# Altium schematic sheet ADC.SchDoc
size 342 x 203 mm; PageSetup: Record=PageOptions|CenterHorizontal=True|CenterVertical=True|PrintScale=0.96|XCorrection=1.00|YCorrection=1.00|PrintKind=2|BorderSize=5000000|LeftOffset=0|BottomOffset=0|Orientation=2|PaperLength=1000|PaperWidth=1000|Scale=100|PaperSource=7|PrintQuality=-4|MediaType=1|DitherType=10|PaperKind=A4|PrintScaleMode=1
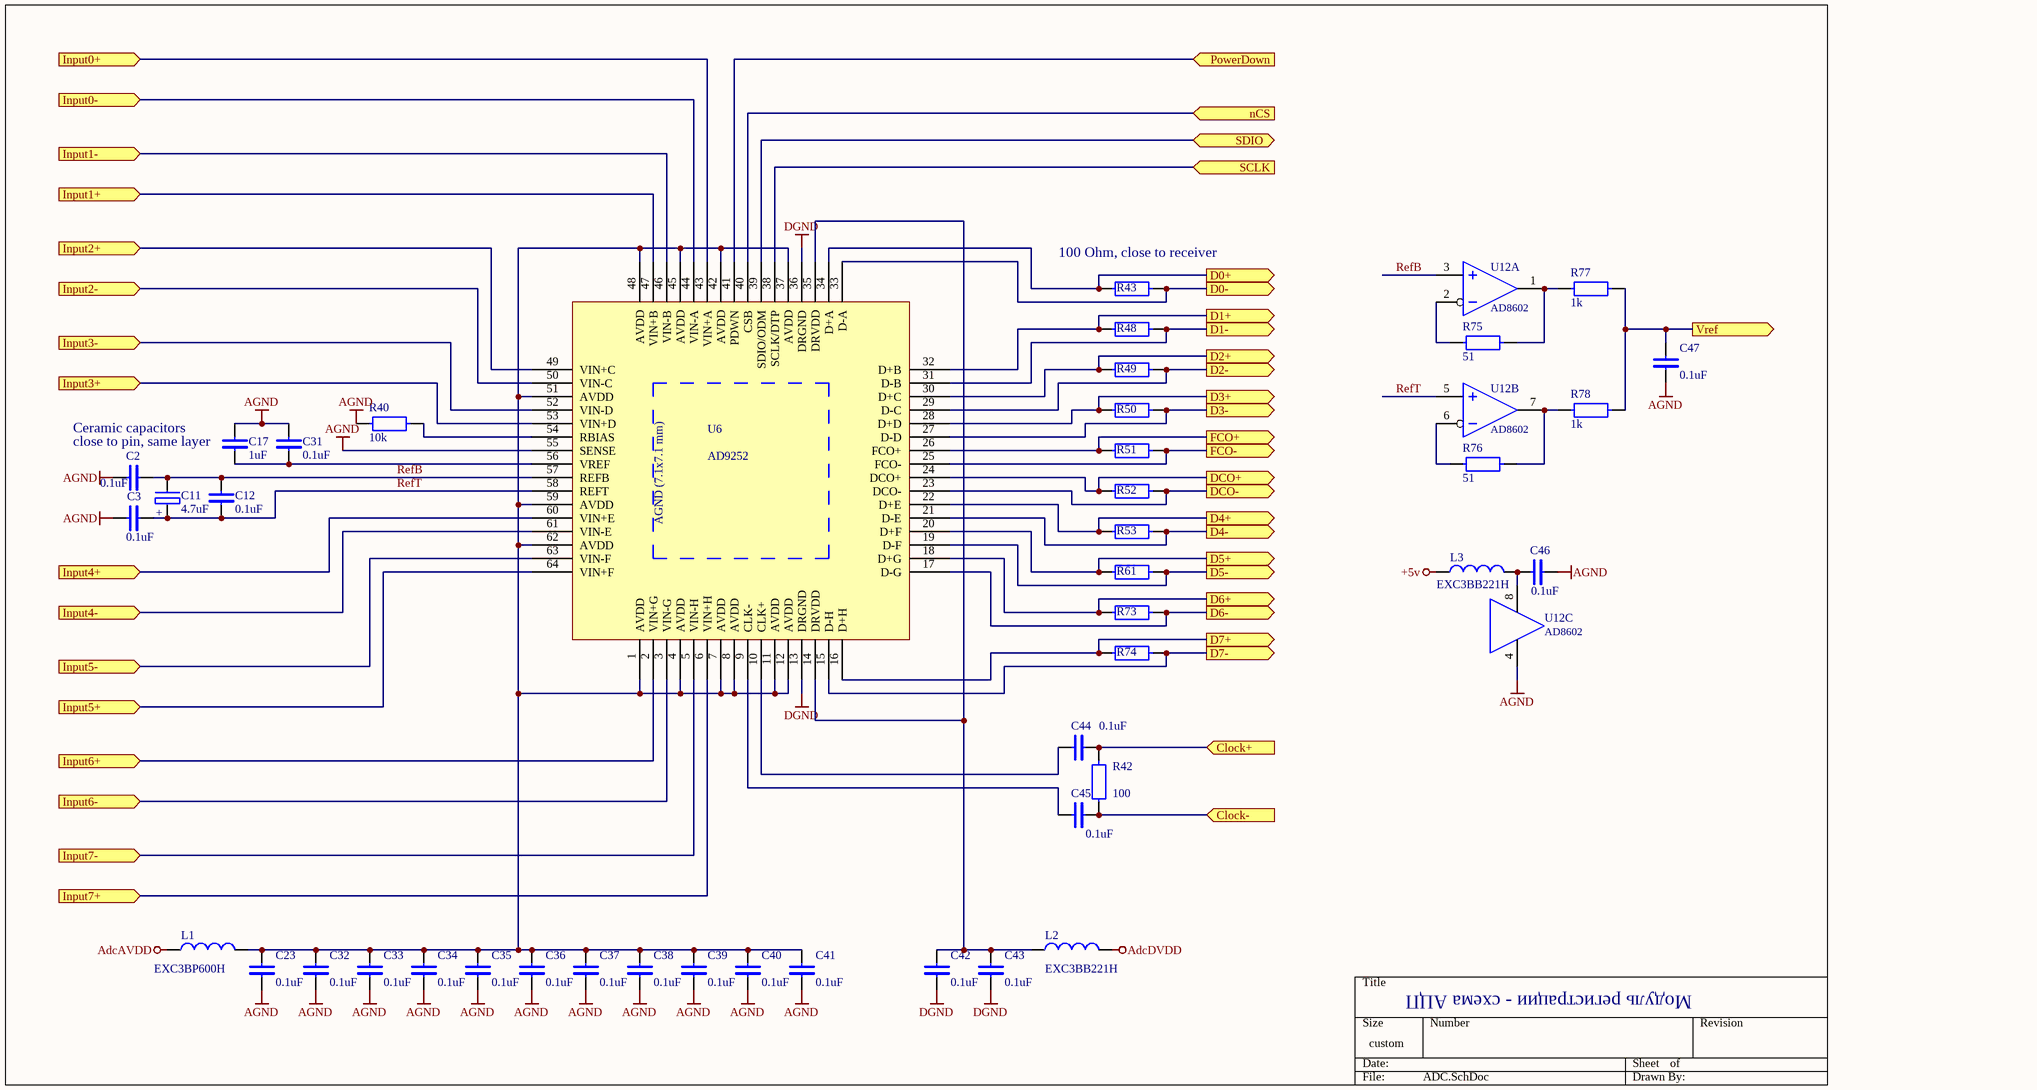
[diagram p0: ADC.SchDoc]

## Parts
C2  0.1uF  [0402]
C3  0.1uF  [0402]
C11  4.7uF  [CP3216]
C12  0.1uF  [0402]
C17  1uF  [0603]
C23  0.1uF  [0402]
C31  0.1uF  [0402]
C32  0.1uF  [0402]
C33  0.1uF  [0402]
C34  0.1uF  [0402]
C35  0.1uF  [0402]
C36  0.1uF  [0402]
C37  0.1uF  [0402]
C38  0.1uF  [0402]
C39  0.1uF  [0402]
C40  0.1uF  [0402]
C41  0.1uF  [0402]
C42  0.1uF  [0402]
C43  0.1uF  [0402]
C44  0.1uF  [0402]
C45  0.1uF  [0402]
C46  0.1uF  [0402]
C47  0.1uF  [0402]
L1  EXC3BP600H  [0603]
L2  EXC3BB221H  [0603]
L3  EXC3BB221H  [0603]
R40  10k  [0603]
R42  100  [0402]
R43  100  [0402]  (value not drawn)
R48  100  [0402]  (value not drawn)
R49  100  [0402]  (value not drawn)
R50  100  [0402]  (value not drawn)
R51  100  [0402]  (value not drawn)
R52  100  [0402]  (value not drawn)
R53  100  [0402]  (value not drawn)
R61  100  [0402]  (value not drawn)
R73  100  [0402]  (value not drawn)
R74  100  [0402]  (value not drawn)
R75  51  [0603]
R76  51  [0603]
R77  1k  [0603]
R78  1k  [0603]
U6  AD9252  [CP-64]
U12  AD8602  [8SOIC150]  (parts A,B,C of 3)

## Ports
Clock+ (in), Clock- (in), D0+ (out), D0- (out), D1+ (out), D1- (out), D2+ (out), D2- (out), D3+ (out), D3- (out), D4+ (out), D4- (out), D5+ (out), D5- (out), D6+ (out), D6- (out), D7+ (out), D7- (out), DCO+ (out), DCO- (out), FCO+ (out), FCO- (out), Input0+ (in), Input0- (in), Input1+ (in), Input1- (in), Input2+ (in), Input2- (in), Input3+ (in), Input3- (in), Input4+ (in), Input4- (in), Input5+ (in), Input5- (in), Input6+ (in), Input6- (in), Input7+ (in), Input7- (in), nCS (in), PowerDown (in), SCLK (in), SDIO (bidir), Vref (out)

## Nets
+5v: L3.1
AdcAVDD: L1.1
AdcDVDD: L2.2
AGND: C2.1 C3.2 C17.2 C23.1 C31.2 C32.1 C33.1 C34.1 C35.1 C36.1 C37.1 C38.1 C39.1 C40.1 C41.1 C46.1 C47.1 R40.1 U6.55(SENSE) U12.4(V-)
DGND: C42.1 C43.1 U6.13(DRGND) U6.36(DRGND)
Clock+: C44.1 R42.2 ; port Clock+
Clock-: C45.1 R42.1 ; port Clock-
D0+: R43.1 U6.34(D+A) ; port D0+
D0-: R43.2 U6.33(D-A) ; port D0-
D1+: R48.1 U6.32(D+B) ; port D1+
D1-: R48.2 U6.31(D-B) ; port D1-
D2+: R49.1 U6.30(D+C) ; port D2+
D2-: R49.2 U6.29(D-C) ; port D2-
D3+: R50.1 U6.28(D+D) ; port D3+
D3-: R50.2 U6.27(D-D) ; port D3-
D4+: R53.1 U6.22(D+E) ; port D4+
D4-: R53.2 U6.21(D-E) ; port D4-
D5+: R61.1 U6.20(D+F) ; port D5+
D5-: R61.2 U6.19(D-F) ; port D5-
D6+: R73.1 U6.18(D+G) ; port D6+
D6-: R73.2 U6.17(D-G) ; port D6-
D7+: R74.1 U6.16(D+H) ; port D7+
D7-: R74.2 U6.15(D-H) ; port D7-
DCO+: R52.1 U6.24(DCO+) ; port DCO+
DCO-: R52.2 U6.23(DCO-) ; port DCO-
FCO+: R51.1 U6.26(FCO+) ; port FCO+
FCO-: R51.2 U6.25(FCO-) ; port FCO-
Input0+: U6.43(VIN+A) ; port Input0+
Input0-: U6.44(VIN-A) ; port Input0-
Input1+: U6.47(VIN+B) ; port Input1+
Input1-: U6.46(VIN-B) ; port Input1-
Input2+: U6.49(VIN+C) ; port Input2+
Input2-: U6.50(VIN-C) ; port Input2-
Input3+: U6.53(VIN+D) ; port Input3+
Input3-: U6.52(VIN-D) ; port Input3-
Input4+: U6.60(VIN+E) ; port Input4+
Input4-: U6.61(VIN-E) ; port Input4-
Input5+: U6.64(VIN+F) ; port Input5+
Input5-: U6.63(VIN-F) ; port Input5-
Input6+: U6.2(VIN+G) ; port Input6+
Input6-: U6.3(VIN-G) ; port Input6-
Input7+: U6.6(VIN+H) ; port Input7+
Input7-: U6.5(VIN-H) ; port Input7-
nCS: U6.40(CSB) ; port nCS
PowerDown: U6.41(PDWN) ; port PowerDown
RefB: C2.2 C11.- C12.2 U6.57(REFB) U12.3(IN+)
RefT: C3.1 C11.+ C12.1 U6.58(REFT) U12.5(IN+)
SCLK: U6.38(SCLK/DTP) ; port SCLK
SDIO: U6.39(SDIO/ODM) ; port SDIO
Vref: C47.2 R77.2 R78.2 ; port Vref
NetC17_1: C17.1 C31.1 U6.56(VREF)
NetC23_2: C23.2 C32.2 C33.2 C34.2 C35.2 C36.2 C37.2 C38.2 C39.2 C40.2 C41.2 L1.2 U6.1(AVDD) U6.4(AVDD) U6.7(AVDD) U6.8(AVDD) U6.11(AVDD) U6.12(AVDD) U6.37(AVDD) U6.42(AVDD) U6.45(AVDD) U6.48(AVDD) U6.51(AVDD) U6.59(AVDD) U6.62(AVDD)
NetC42_2: C42.2 C43.2 L2.1 U6.14(DRVDD) U6.35(DRVDD)
NetC44_2: C44.2 U6.10(CLK+)
NetC45_2: C45.2 U6.9(CLK-)
NetC46_2: C46.2 L3.2 U12.8(V+)
NetR40_2: R40.2 U6.54(RBIAS)
NetR75_1: R75.1 U12.2(IN-)
NetR75_2: R75.2 R77.1 U12.1(OUT)
NetR76_1: R76.1 U12.6(IN-)
NetR76_2: R76.2 R78.1 U12.7(OUT)

## Notes on the sheet
- (near R43) 100 Ohm, close to receiver
- Ceramic capacitors
- (near C17) close to pin, same layer
- Модуль регистрации - схема АЦП
- (in symbol AD9252) AGND (7.1x7.1 mm)

## Library data of the parts
C2 C3 C12 C17 C23 C31-C47 = c
C11 = c+
L1-L3 = INDUCTOR
R40 R42 R43 R48-R53 R61 R73-R78 = r
U6 = AD9252: Octal, 14-bit, 50 MSPS, Serial LVDS, 1.8V ADC
U12 = AD8602: 8 MHz Rail-to-Rail Operational Amplifiers; Value: AD8602